# Altium schematic sheet AUDIO.SchDoc: Audio Codec WOLFSON and connectors
size A4; Date: 25-FEB-2015; Author: A.B; CompanyName: STMicroelectronics; Address1: 12, Rue Jules HOROWITZ; Address2: 38019 Grenoble; Address3: FRANCE; DocumentNumber: MB1191; Revision: B-02; SheetNumber: 6; SheetTotal: 14; Project: STM32F746G-DISCO
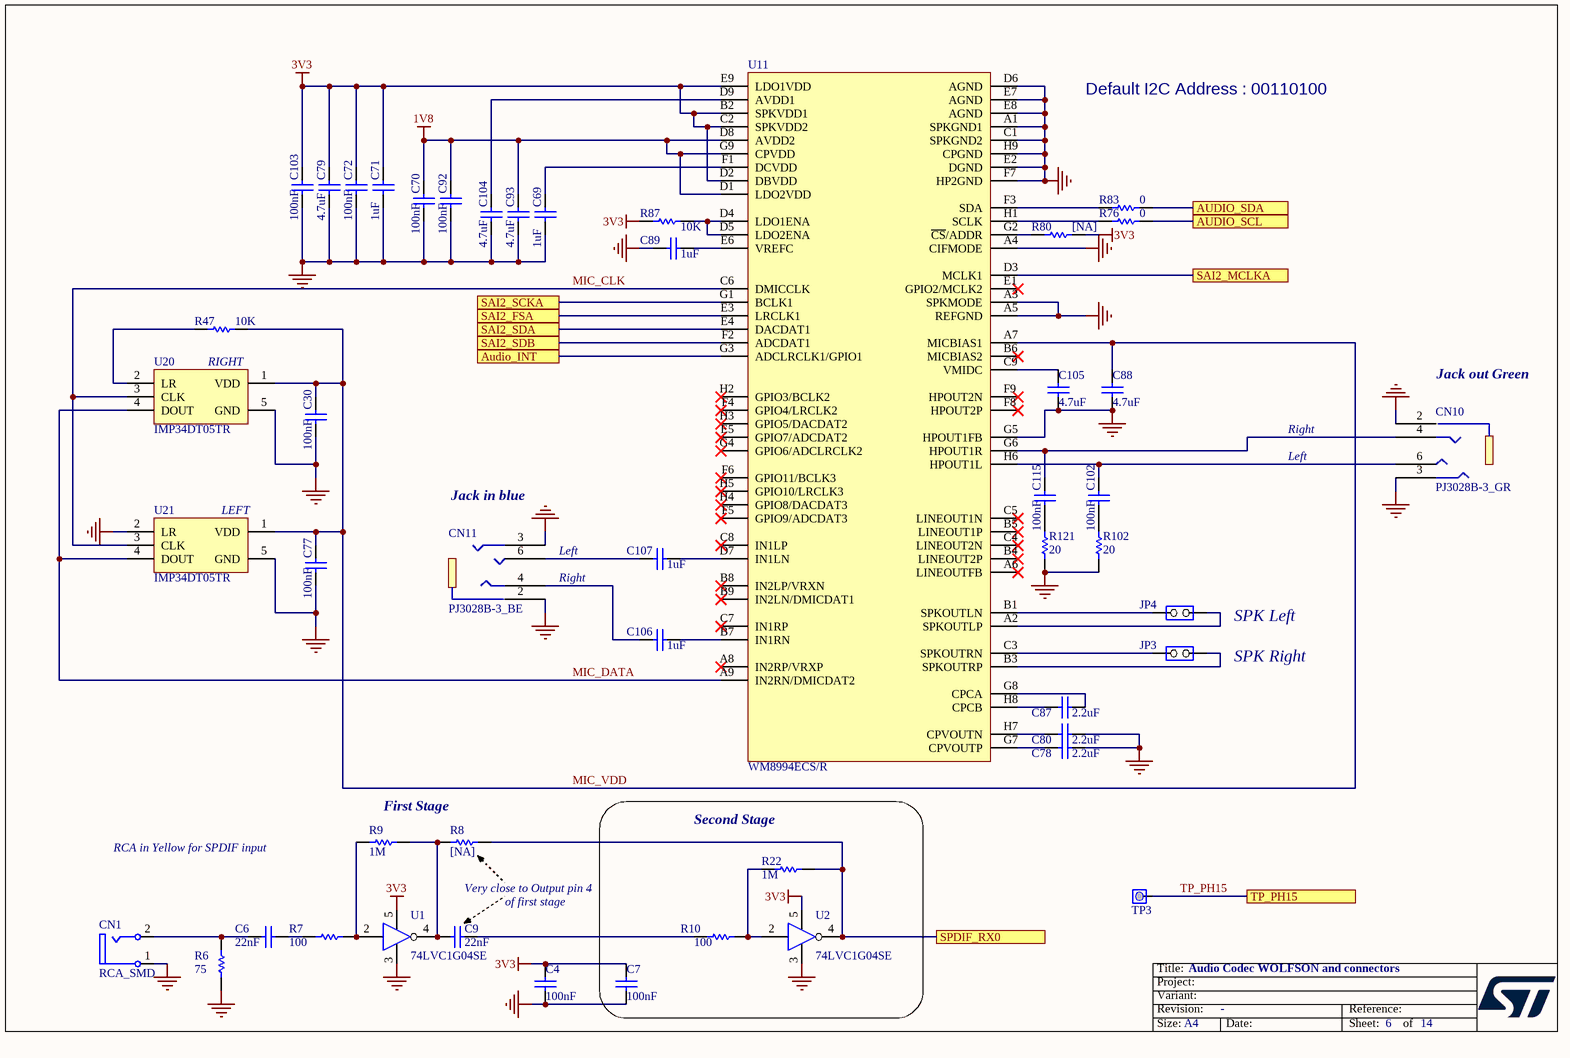
[diagram p0: AUDIO.SchDoc]

## Parts
C4  100nF  [0402C]
C6  22nF  [0402C]
C7  100nF  [0402C]
C9  22nF  [0402C]
C30  100nF  [0402C]
C69  1uF  [0603C]
C70  100nF  [0402C]
C71  1uF  [0603C]
C72  100nF  [0402C]
C77  100nF  [0402C]
C78  2.2uF  [0603C]
C79  4.7uF  [0603C]
C80  2.2uF  [0603C]
C87  2.2uF  [0603C]
C88  4.7uF  [0603C]
C89  1uF  [0603C]
C92  100nF  [0402C]
C93  4.7uF  [0603C]
C102  100nF  [0402C]
C103  100nF  [0402C]
C104  4.7uF  [0603C]
C105  4.7uF  [0603C]
C106  1uF  [0603C]
C107  1uF  [0603C]
C115  100nF  [0402C]
CN1  RCA_SMD  [RCA_SMD]
CN10  PJ3028B-3_GR  [PJ3028B]
CN11  PJ3028B-3_BE  [PJ3028B]
JP3  Jumper 2 pins  [SIP2/2.54]  (value not drawn)
JP4  Jumper 2 pins  [SIP2/2.54]  (value not drawn)
R6  75  [0402R]
R7  100  [0402R]
R8  [NA]  [0402R]
R9  1M  [0402R]
R10  100  [0402R]
R22  1M  [0402R]
R47  10K  [0402R]
R76  0  [0402R]
R80  [NA]  [0402R]
R83  0  [0402R]
R87  10K  [0402R]
R102  20  [0402R]
R121  20  [0402R]
TP3  Test point 1 pin with hole  [SIP1/2.54]  (value not drawn)
U1  74LVC1G04SE  [SOT353]
U2  74LVC1G04SE  [SOT353]
U11  WM8994ECS/R  [BGA72_0R5_4R5X4]
U20  IMP34DT05TR  [HCLGA_3X4X1_4LD]
U21  IMP34DT05TR  [HCLGA_3X4X1_4LD]

## Blocks framed on the sheet
Second Stage: C7 R10 R22 U2

## Ports
Audio_INT, AUDIO_SCL, AUDIO_SDA, SAI2_FSA, SAI2_MCLKA, SAI2_SCKA, SAI2_SDA, SAI2_SDB, SPDIF_RX0, TP_PH15

## Nets
1V8: C70.1 C92.1 C93.1 U11.D1(LDO2VDD) U11.D8(AVDD2) U11.G9(CPVDD)
3V3: C4.2 C7.2 C71.2 C72.1 C79.1 C103.1 R80.2 R87.2 U1.5(VCC) U2.5(VCC) U11.B2(SPKVDD1) U11.C2(SPKVDD2) U11.D2(DBVDD) U11.E9(LDO1VDD)
GND: C4.1 C7.1 C30.2 C69.1 C70.2 C71.1 C72.2 C77.2 C78.2 C79.2 C80.2 C88.1 C89.2 C92.2 C93.2 C103.2 C104.2 C105.1 CN1.1(Ground) CN10.2 CN10.3 CN11.2 CN11.3 R6.1 R102.2 R121.2 U1.3(GND) U2.3(GND) U11.A1(SPKGND1) U11.A3(SPKMODE) U11.A4(CIFMODE) U11.A5(REFGND) U11.C1(SPKGND2) U11.D6(AGND) U11.E2(DGND) U11.E7(AGND) U11.E8(AGND) U11.F7(HP2GND) U11.G5(HPOUT1FB) U11.H9(CPGND) U20.5(GND) U21.2(LR) U21.5(GND)
Audio_INT: U11.G3(ADCLRCLK1/GPIO1) ; port Audio_INT
AUDIO_SCL: R76.1 ; port AUDIO_SCL
AUDIO_SDA: R83.1 ; port AUDIO_SDA
MIC_CLK: U11.C6(DMICCLK) U20.3(CLK) U21.3(CLK)
MIC_DATA: U11.A9(IN2RN/DMICDAT2) U20.4(DOUT) U21.4(DOUT)
MIC_VDD: C30.1 C77.1 C88.2 R47.2 U11.A7(MICBIAS1) U20.1(VDD) U21.1(VDD)
SAI2_FSA: U11.E3(LRCLK1) ; port SAI2_FSA
SAI2_MCLKA: U11.D3(MCLK1) ; port SAI2_MCLKA
SAI2_SCKA: U11.G1(BCLK1) ; port SAI2_SCKA
SAI2_SDA: U11.E4(DACDAT1) ; port SAI2_SDA
SAI2_SDB: U11.F2(ADCDAT1) ; port SAI2_SDB
SPDIF_RX0: R8.2 R22.2 U2.4(Y) ; port SPDIF_RX0
TP_PH15: TP3.1(COMMON) ; port TP_PH15
NetC6_1: C6.1 CN1.2(Signal) R6.2
NetC6_2: C6.2 R7.1
NetC9_1: C9.1 R8.1 R9.2 U1.4(Y)
NetC9_2: C9.2 R10.1
NetC69_2: C69.2 U11.F1(DCVDD)
NetC78_1: C78.1 U11.G7(CPVOUTP)
NetC80_1: C80.1 U11.H7(CPVOUTN)
NetC87_1: C87.1 U11.H8(CPCB)
NetC87_2: C87.2 U11.G8(CPCA)
NetC89_1: C89.1 U11.E6(VREFC)
NetC102_1: C102.1 CN10.6 U11.H6(HPOUT1L)
NetC102_2: C102.2 R102.1
NetC104_1: C104.1 U11.D9(AVDD1)
NetC105_2: C105.2 U11.C9(VMIDC)
NetC106_1: C106.1 U11.B7(IN1RN)
NetC106_2: C106.2 CN11.4
NetC107_1: C107.1 U11.D7(IN1LN)
NetC107_2: C107.2 CN11.6
NetC115_1: C115.1 CN10.4 U11.G6(HPOUT1R)
NetC115_2: C115.2 R121.1
NetJP3_1: JP3.1(COMMON) U11.C3(SPKOUTRN)
NetJP3_2: JP3.2(NO) U11.B3(SPKOUTRP)
NetJP4_1: JP4.1(COMMON) U11.B1(SPKOUTLN)
NetJP4_2: JP4.2(NO) U11.A2(SPKOUTLP)
NetR7_2: R7.2 R9.1 U1.2(A)
NetR10_2: R10.2 R22.1 U2.2(A)
NetR47_1: R47.1 U20.2(LR)
NetR76_2: R76.2 U11.H1(SCLK)
NetR80_1: R80.1 U11.G2(~{CS}/ADDR)
NetR83_2: R83.2 U11.F3(SDA)
NetR87_1: R87.1 U11.D4(LDO1ENA) U11.D5(LDO2ENA)

Not connected (* = marked no-connect by the designer): U1 1(NC); U2 1(NC); U11 A6(LINEOUTFB)* A8(IN2RP/VRXP)* B4(LINEOUT2P)* B5(LINEOUT1P)* B6(MICBIAS2)* B8(IN2LP/VRXN)* B9(IN2LN/DMICDAT1)* C4(LINEOUT2N)* C5(LINEOUT1N)* C7(IN1RP)* C8(IN1LP)* E1(GPIO2/MCLK2)* E5(GPIO7/ADCDAT2)* F4(GPIO4/LRCLK2)* F5(GPIO9/ADCDAT3)* F6(GPIO11/BCLK3)* F8(HPOUT2P)* F9(HPOUT2N)* G4(GPIO6/ADCLRCLK2)* H2(GPIO3/BCLK2)* H3(GPIO5/DACDAT2)* H4(GPIO8/DACDAT3)* H5(GPIO10/LRCLK3)*

## Notes on the sheet
- Default I2C Address : 00110100
- (near U20) RIGHT
- (near CN10) Jack out Green
- Right
- (near U21) LEFT
- (near CN11) Jack in blue
- Left
- SPK Left
- SPK Right
- RCA in Yellow for SPDIF input
- First Stage
- Very close to Output pin 4
- of first stage
- Title:
- Project:
- Size:
- Revision:
- Variant:
- A4
- -
- Date:
- Reference:
- Sheet:
- of

## Library data of the parts
C4 C7 C30 C70 C72 C77 C92 C102 C103 C115 = Cap_100nF_X7R_10%_0402: Capacitor,100nF,16V,X7R,10%,0402,YAGEO; Manuf_Part_1: CC0402KRX7R7BB104; Revision: July-2002: Re-released for DXP Platform.; Value: 100nF; Order: CC0402KRX7R7BB104; Manuf_1: YAGEO
  C30 C70 C72 C77 C92 C102 C103 C115: ECCN_US/EU: n/a
C6 C9 = Cap_22nF_X7R_10%_0402: Capacitor,22nF,16V,X7R,10%,0402,YAGEO; Manuf_Part_1: CC0402KRX7R7BB223; Revision: July-2002: Re-released for DXP Platform.; Value: 22nF; Order: CC0402KRX7R7BB223; Manuf_1: YAGEO; ECCN_US/EU: n/a
C69 C71 C89 C106 C107 = Cap_1uF_X5R_10%_0603: Capacitor,1uF,16V,X5R,10%,0603,YAGEO; Manuf_Part_1: CC0603KRX5R7BB105; Revision: July-2002: Re-released for DXP Platform.; Value: 1uF; Order: CC0603KRX5R7BB105; Manuf_1: YAGEO; ECCN_US/EU: n/a
C78 C80 C87 = Cap_2.2uF_X5R_10%_0603: Capacitor,2.2uF,10V, X5R,10%,0603,YAGEO; Manuf_Part_1: CC0603KRX5R6BB225; Manuf_Part_2: C0603C225K8PACTU; Manuf_2: KEMET; Revision: July-2002: Re-released for DXP Platform.; Value: 2.2uF; Order: *; Manuf_1: YAGEO; ECCN_US/EU: n/a
C79 C88 C93 C104 C105 = Cap_4.7uF_X5R_10%_0603: Capacitor,4.7uF,16V, X5R,10%,0603,YAGEO; Manuf_Part_1: CC0603KRX5R7BB475; Order: CC0603KRX5R7BB105; Revision: July-2002: Re-released for DXP Platform.; Value: 4.7uF; Manuf_1: YAGEO; ECCN_US/EU: n/a
CN1 = RCA_SMD: RCA Phono Jack, Right Angle, SMD, Yellow; Manuf_Part_1: JBB0819100002; Manuf_1: Jiubaba
CN10 = PJ3028B-3_GR: Connector Jack Stereo 3.5mm, female SMT, Green (Line output); Manuf_1: qiaod; Manuf_Part_2: PJ30280-3_GR; ECCN_US/EU: n/a; Manuf_Part_1: PJ3028B-3_GR
CN11 = PJ3028B-3_BE: Connector Jack Stereo 3.5mm, female SMT, Blue (Line input); Manuf_1: qiaod; Manuf_Part_2: PJ30280-3_BE; ECCN_US/EU: n/a; Manuf_Part_1: PJ3028B-3_BE
JP3 JP4 = Jumper2: Fitted: NO; ECCN_US/EU: n/a
R6 = Res_75_1%_0402: Resistor,75,0402,1%,YAGEO; Manuf_Part_1: RC0402FR-0775RL; Order: 311-75.0LRTR-ND; Value: 75; Manuf_1: YAGEO; ECCN_US/EU: n/a; Distrib: DIGIKEY
R7 R10 = Res_100_1%_0402: Resistor,100,0402,1%,YAGEO; Manuf_Part_1: RC0402FR-07100RL; Order: 9239111; Value: 100; Manuf_1: YAGEO; ECCN_US/EU: n/a; Distrib: FARNELL
R8 R80 = Res_NA_0402: Resistor,[NA],0402; Fitted: NO; Value: [NA]; ECCN_US/EU: n/a
R9 R22 = Res_1M_1%_0402: Resistor,1M,0402,1%,YAGEO; Manuf_Part_1: RC0402FR-071ML; Value: 1M; Manuf_1: YAGEO; Order: RC0402FR-071ML; ECCN_US/EU: n/a
R47 R87 = Res_10K_1%_0402: Resistor,10K,0402,1%,YAGEO; Manuf_Part_1: RC0402FR-0710KL; Value: 10K; Manuf_1: YAGEO; Order: RC0402FR-0710KL; ECCN_US/EU: n/a
R76 R83 = Res_0_5%_0402: Resistor,0,0402,5%,YAGEO; Manuf_Part_1: RC0402JR-070RL; Order: 2363467; Value: 0; ECCN_US/EU: n/a; Manuf_1: YAGEO; Distrib: FARNELL
R102 R121 = Res_20_1%_0402: Resistor,20,0402,1%,YAGEO; Manuf_Part_1: RC0402FR-0720RL; Value: 20; Manuf_1: YAGEO; Order: *; ECCN_US/EU: n/a
TP3 = TP1: Test Point; Fitted: NO; ECCN_US/EU: n/a
U1 U2 = 74LVC1G04SE: Single inverter gate with a standard push-pull output. (1.65V to 5.5V); Manuf_Part_1: 74LVC1G04SE-7; Manuf_1: DIODES; Order: 1845218; ECCN_US/EU: EAR99/NEC; Distrib: FARNELL
U11 = WM8994ECS/R: Multi-Channel Audio Hub CODEC for Smartphones; Manuf_1: Cirrus Logic; ECCN_US/EU: EAR99/NEC; Manuf_Part_1: WM8994ECS/R; Distrib: Cirrus Logic
U20 U21 = IMP34DT05TR: MEMS audio sensor omnidirectional digital microphone for industrial applications; Manuf_1: STMICROELECTRONICS; ECCN_US/EU: EAR99/NEC; provided: SUBCO with ST control; Manuf_Part_1: IMP34DT05TR; value: IMP34DT05TR